# EAGLE schematic final_schematic (EAGLE 8.7.1)

## Sheet 1 of 4
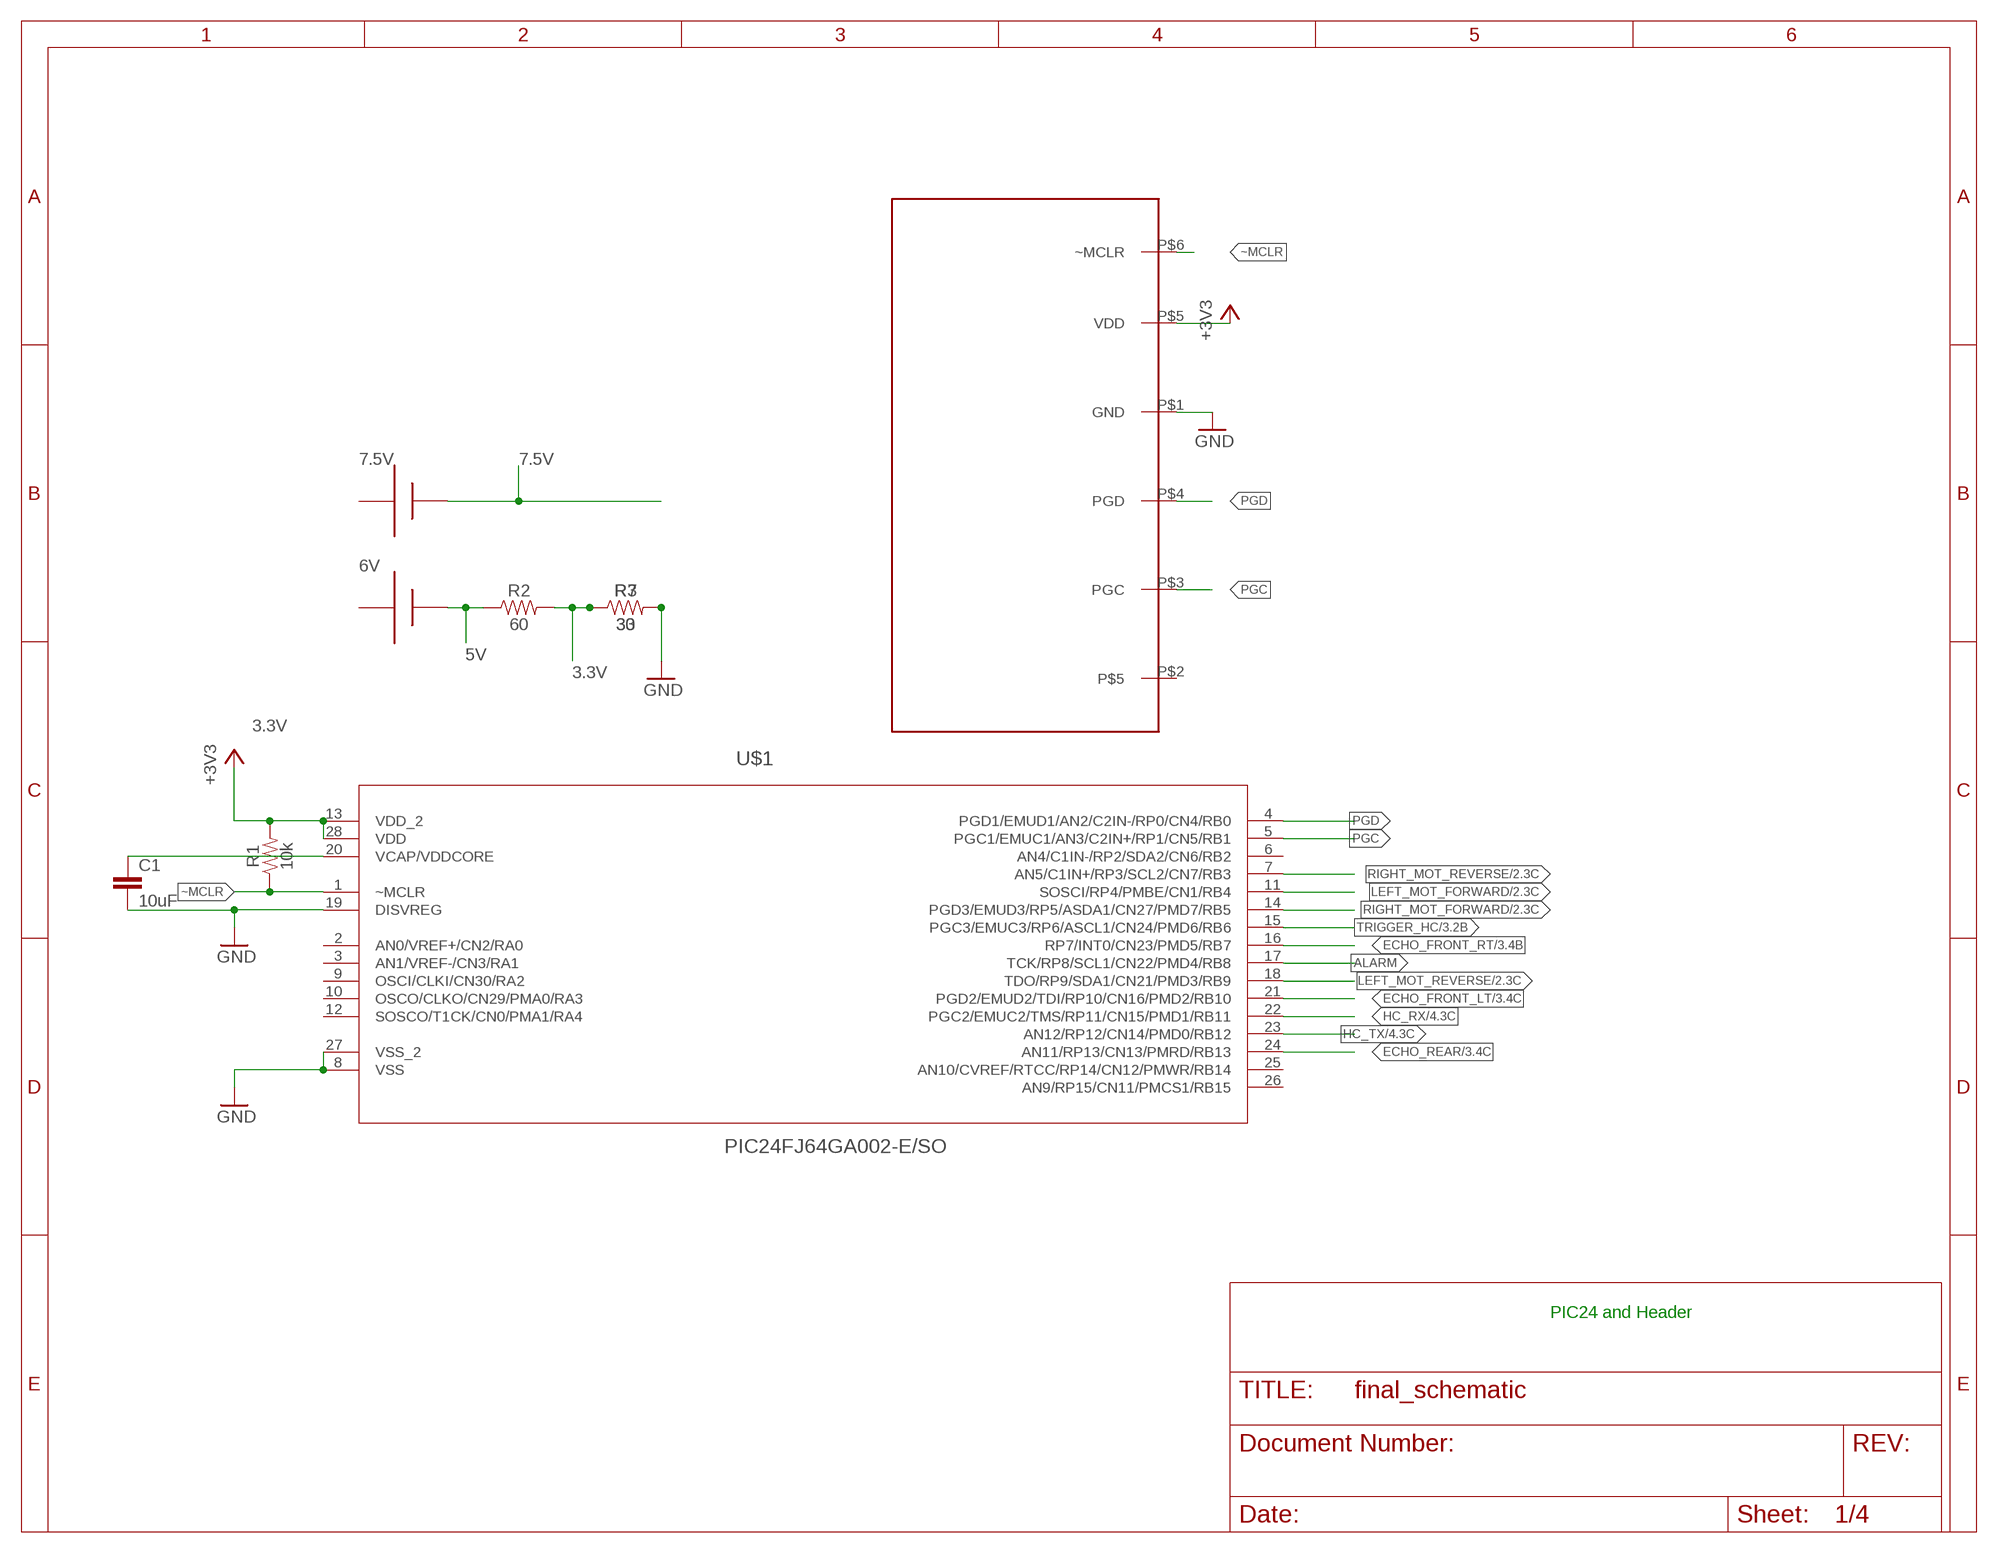
[diagram p0: schematic, sheet 1]

### Parts
6V  AAA  [12BH412]
7.5V  AAA  [12BH412]
C1  10uF  10UF-0603-6.3V-20%  [0603]
R1  10k  10KOHM-0603-1/10W-1%  [0603]
R2  60  33OHM-0603-1/10W-1%  [0603]
R3  33  33OHM-0603-1/10W-1%  [0603]
R7  30  33OHM-0603-1/10W-1%  [0603]
U$1  PIC24FJ64GA002-E/SO  [SOIC127P1030X265-28N]
U$2  CHIPKITHEADER  [HEADER]

### Nets
3.3V: R1.2 R2.2 R3.1 R7.1 U$1.13(VDD_2) U$1.28(VDD) ; supply symbol labelled +3V3 ; also sheet 3
5V: 6V.+ R2.1 ; also sheet 2,3,4
7.5V: 7.5V.+ ; also sheet 2
+3V3: U$2.P$5(VDD)
ALARM: U$1.17(TCK/RP8/SCL1/CN22/PMD4/RB8)
ECHO_FRONT_LT: U$1.21(PGD2/EMUD2/TDI/RP10/CN16/PMD2/RB10) ; also sheet 3
ECHO_FRONT_RT: U$1.16(RP7/INT0/CN23/PMD5/RB7) ; also sheet 3
ECHO_REAR: U$1.24(AN11/RP13/CN13/PMRD/RB13) ; also sheet 3
GND: C1.2 R3.2 R7.2 U$1.8(VSS) U$1.19(DISVREG) U$1.27(VSS_2) U$2.P$1(GND) ; also sheet 2,3,4
HC_RX: U$1.22(PGC2/EMUC2/TMS/RP11/CN15/PMD1/RB11) ; also sheet 4
HC_TX: U$1.23(AN12/RP12/CN14/PMD0/RB12) ; also sheet 4
LEFT_MOT_FORWARD: U$1.11(SOSCI/RP4/PMBE/CN1/RB4) ; also sheet 2
LEFT_MOT_REVERSE: U$1.18(TDO/RP9/SDA1/CN21/PMD3/RB9) ; also sheet 2
N$4: C1.1 U$1.20(VCAP/VDDCORE)
PGC: U$1.5(PGC1/EMUC1/AN3/C2IN+/RP1/CN5/RB1) U$2.P$3(PGC)
PGD: U$1.4(PGD1/EMUD1/AN2/C2IN-/RP0/CN4/RB0) U$2.P$4(PGD)
RIGHT_MOT_FORWARD: U$1.14(PGD3/EMUD3/RP5/ASDA1/CN27/PMD7/RB5) ; also sheet 2
RIGHT_MOT_REVERSE: U$1.7(AN5/C1IN+/RP3/SCL2/CN7/RB3) ; also sheet 2
TRIGGER_HC: U$1.15(PGC3/EMUC3/RP6/ASCL1/CN24/PMD6/RB6) ; also sheet 3
~MCLR: R1.1 U$1.1(~MCLR) U$2.P$6(~MCLR)
Unconnected: 6V.- 7.5V.- U$1.2(AN0/VREF+/CN2/RA0) U$1.3(AN1/VREF-/CN3/RA1) U$1.6(AN4/C1IN-/RP2/SDA2/CN6/RB2) U$1.9(OSCI/CLKI/CN30/RA2) U$1.10(OSCO/CLKO/CN29/PMA0/RA3) U$1.12(SOSCO/T1CK/CN0/PMA1/RA4) U$1.25(AN10/CVREF/RTCC/RP14/CN12/PMWR/RB14) U$1.26(AN9/RP15/CN11/PMCS1/RB15) U$2.P$2

### Notes on the sheet
- PIC24 and Header

## Sheet 2 of 4
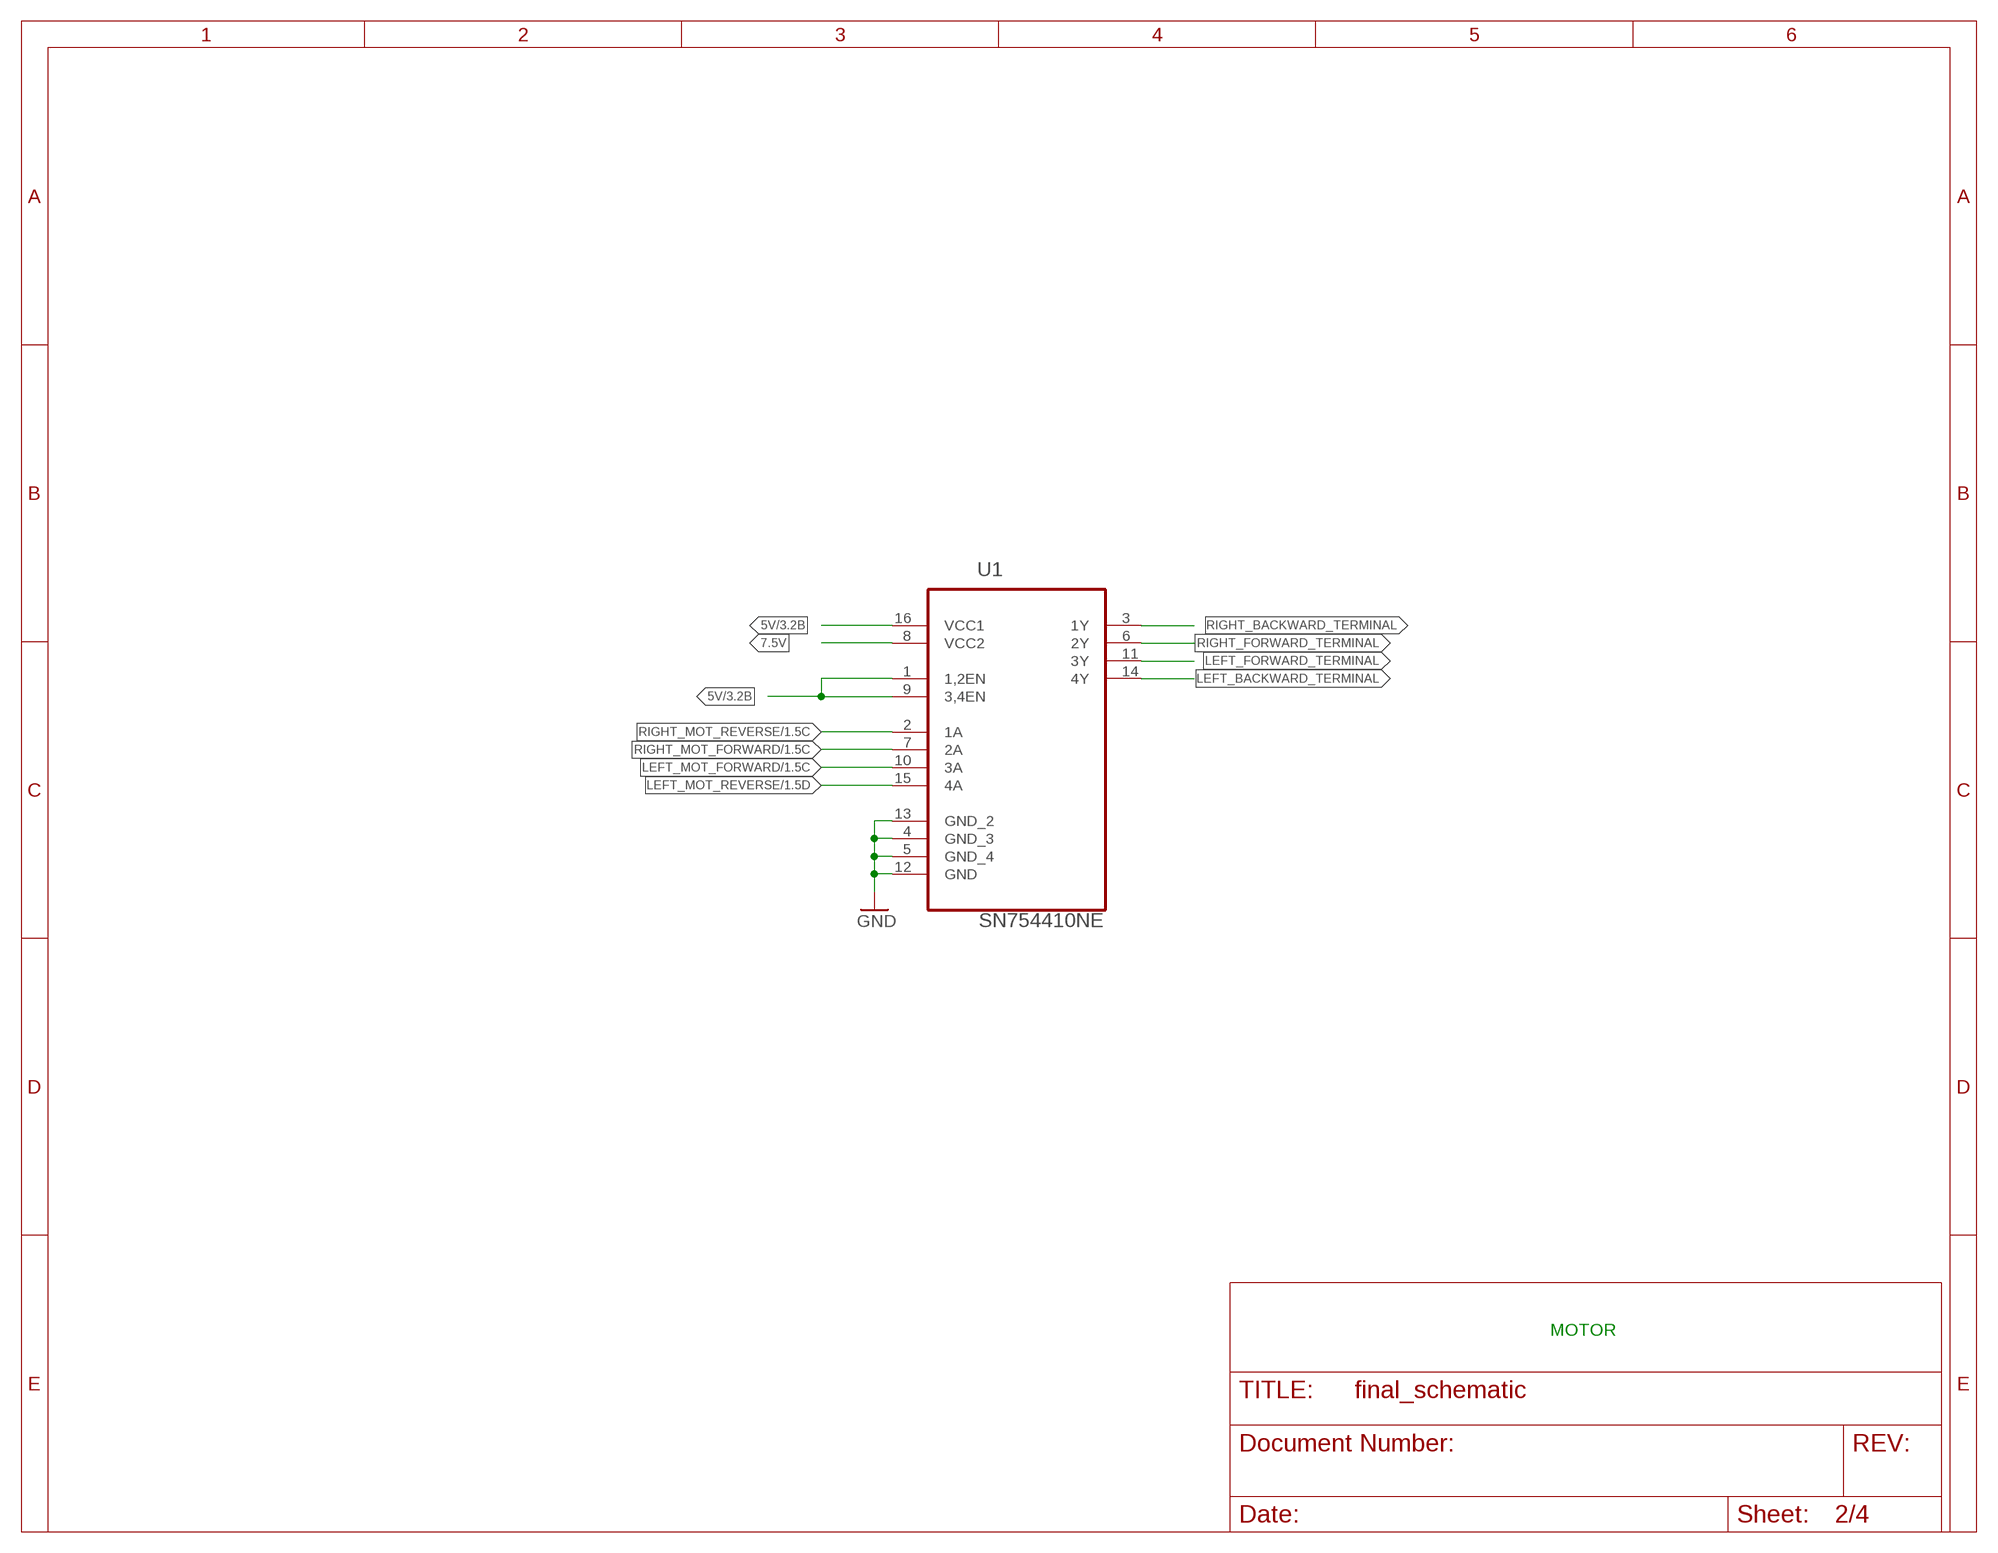
[diagram p1: schematic, sheet 2]

### Parts
U1  SN754410NE  [DIP254P762X508-16]

### Nets
5V: U1.1(1,2EN) U1.9(3,4EN) U1.16(VCC1) ; also sheet 1,3,4
7.5V: U1.8(VCC2) ; also sheet 1
GND: U1.4(GND_3) U1.5(GND_4) U1.12(GND) U1.13(GND_2) ; also sheet 1,3,4
LEFT_BACKWARD_TERMINAL: U1.14(4Y)
LEFT_FORWARD_TERMINAL: U1.11(3Y)
LEFT_MOT_FORWARD: U1.10(3A) ; also sheet 1
LEFT_MOT_REVERSE: U1.15(4A) ; also sheet 1
RIGHT_BACKWARD_TERMINAL: U1.3(1Y)
RIGHT_FORWARD_TERMINAL: U1.6(2Y)
RIGHT_MOT_FORWARD: U1.7(2A) ; also sheet 1
RIGHT_MOT_REVERSE: U1.2(1A) ; also sheet 1

### Notes on the sheet
- MOTOR

## Sheet 3 of 4
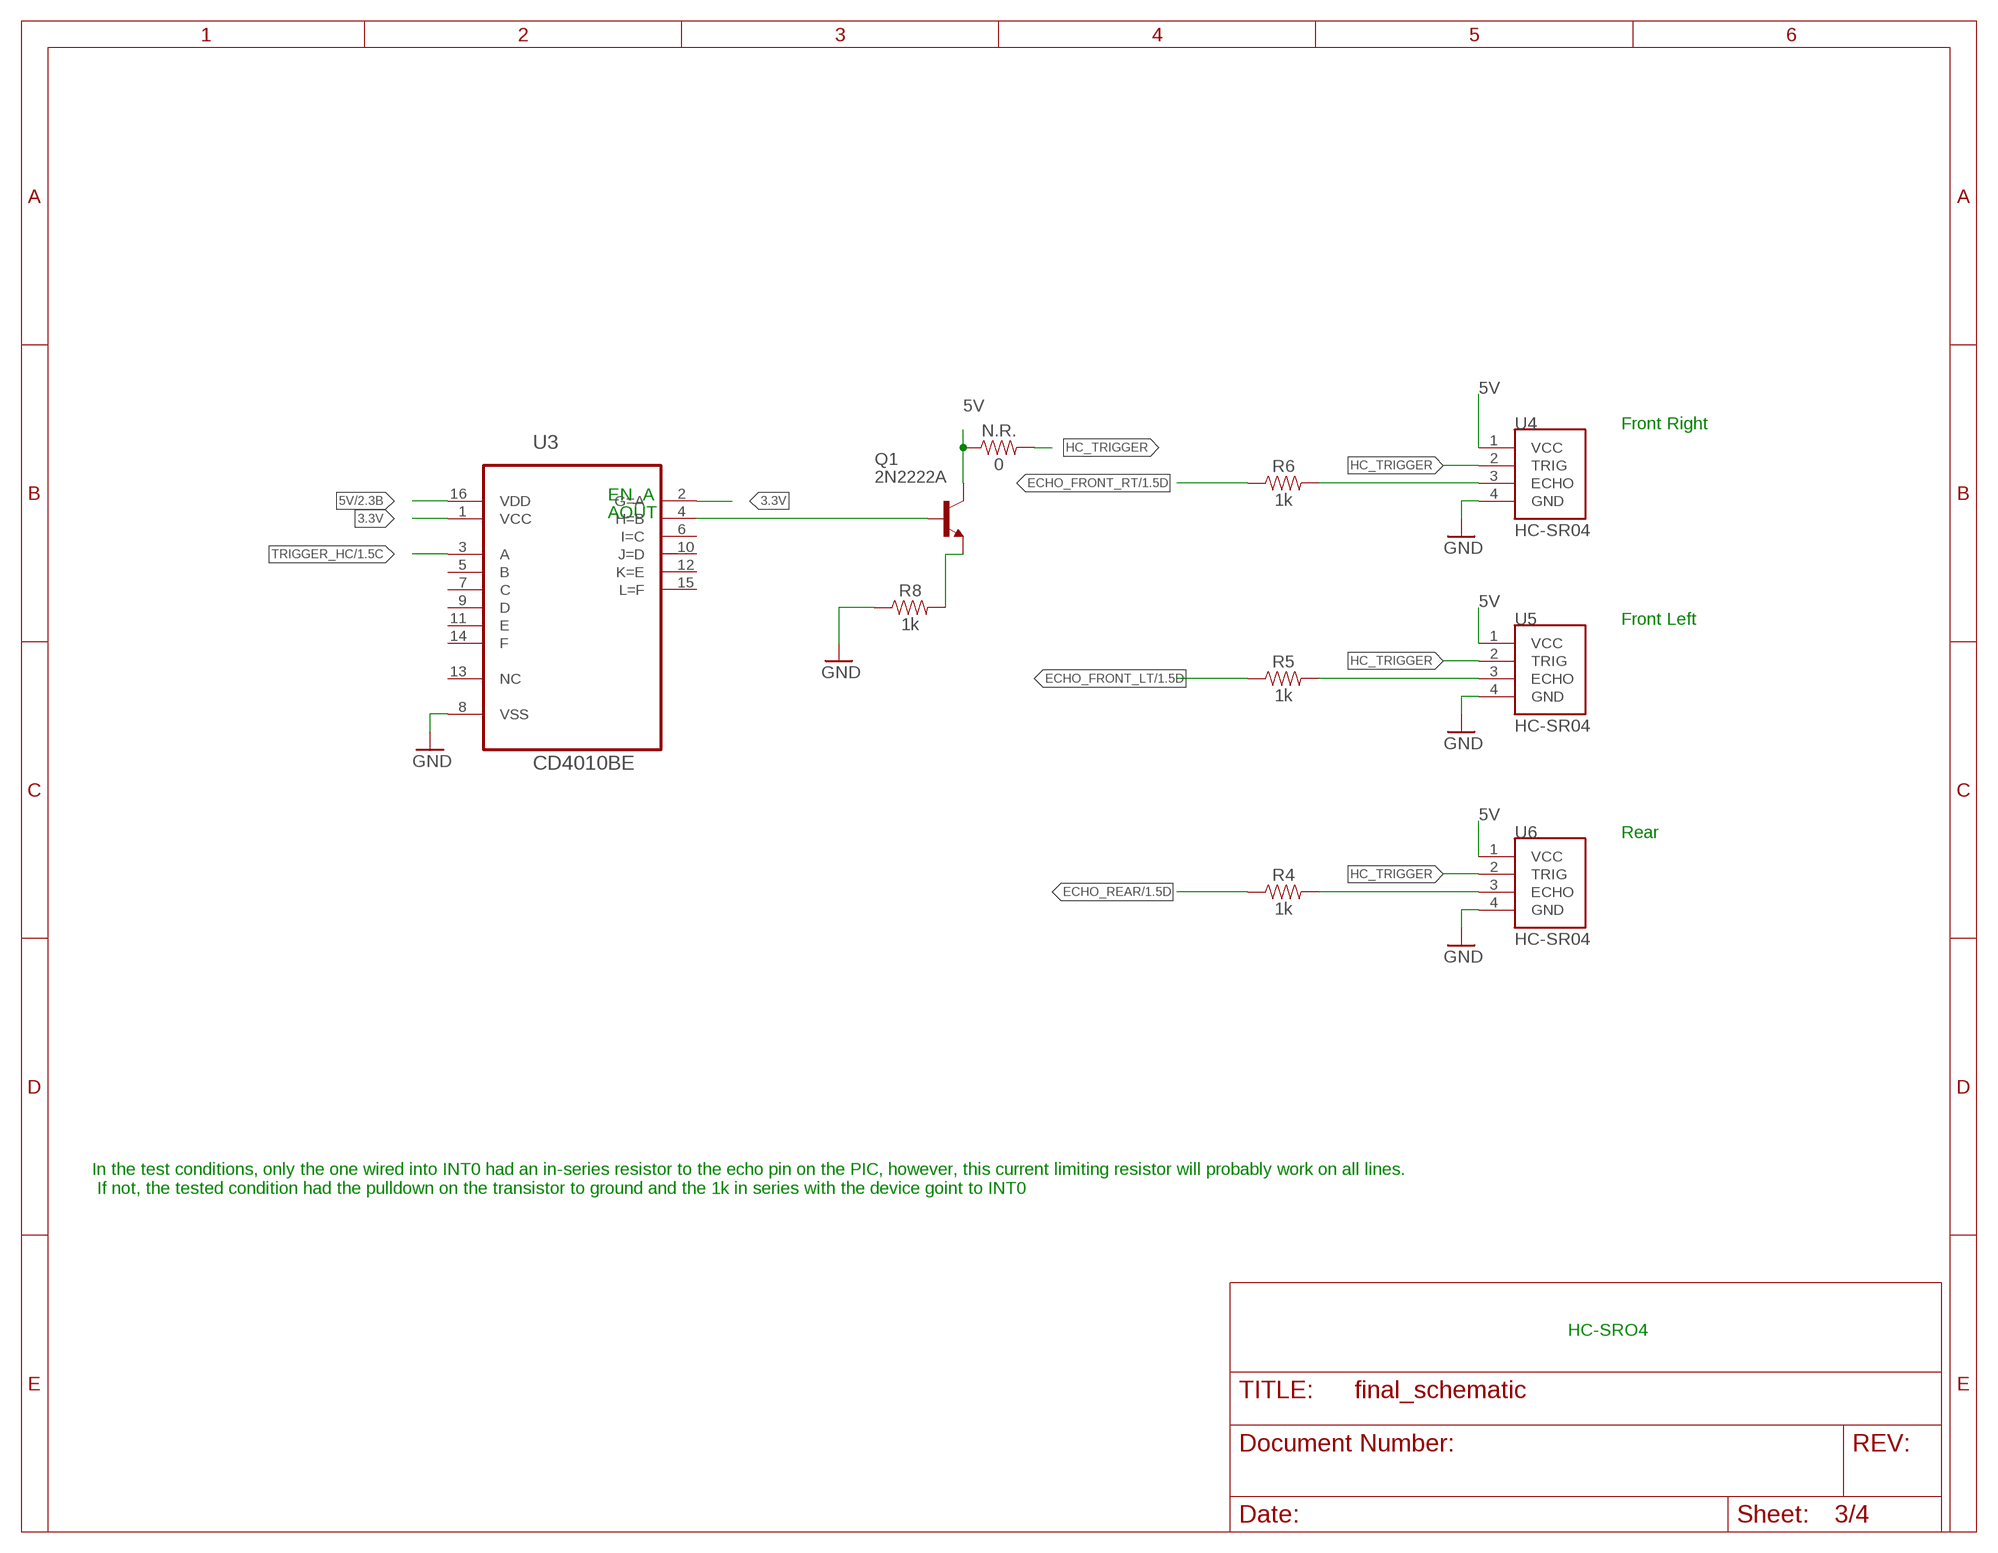
[diagram p2: schematic, sheet 3]

### Parts
N.R.  0  0.1OHM-1210-1/2W-1%  [1210]
Q1  2N2222A  [TO18]
R4  1k  1KOHM-0603-1/10W-1%  [0603]
R5  1k  1KOHM-0603-1/10W-1%  [0603]
R6  1k  1KOHM-0603-1/10W-1%  [0603]
R8  1k  1KOHM-0603-1/10W-1%  [0603]
U3  CD4010BE  [DIP254P762X508-16]
U4  HC-SR04  [XCVR_HC-SR04]
U5  HC-SR04  [XCVR_HC-SR04]
U6  HC-SR04  [XCVR_HC-SR04]

### Nets
3.3V: U3.1(VCC) U3.2(G=A) ; also sheet 1
5V: N.R..1 Q1.3(C) U3.16(VDD) U4.1(VCC) U5.1(VCC) U6.1(VCC) ; also sheet 1,2,4
ECHO_FRONT_LT: R5.1 ; also sheet 1
ECHO_FRONT_RT: R6.1 ; also sheet 1
ECHO_REAR: R4.1 ; also sheet 1
GND: R8.1 U3.8(VSS) U4.4(GND) U5.4(GND) U6.4(GND) ; also sheet 1,2,4
HC_TRIGGER: N.R..2 Q1.1(E) Q1.2(B) R8.2 U3.4(H=B) U4.2(TRIG) U5.2(TRIG) U6.2(TRIG)
N$1: R4.2 U6.3(ECHO)
N$2: R6.2 U4.3(ECHO)
N$3: R5.2 U5.3(ECHO)
TRIGGER_HC: U3.3(A) ; also sheet 1
Unconnected: U3.5(B) U3.6(I=C) U3.7(C) U3.9(D) U3.10(J=D) U3.11(E) U3.12(K=E) U3.13(NC) U3.14(F) U3.15(L=F)

### Notes on the sheet
- Front Right
- EN_A
- AOUT
- Front Left
- Rear
- In the test conditions, only the one wired into INT0 had an in-series resistor to the echo pin on the PIC, however, this current limiting resistor will probably work on all lines.
   If not, the tested condition had the pulldown on the transistor to ground and the 1k in series with the device goint to INT0
- HC-SRO4

## Sheet 4 of 4
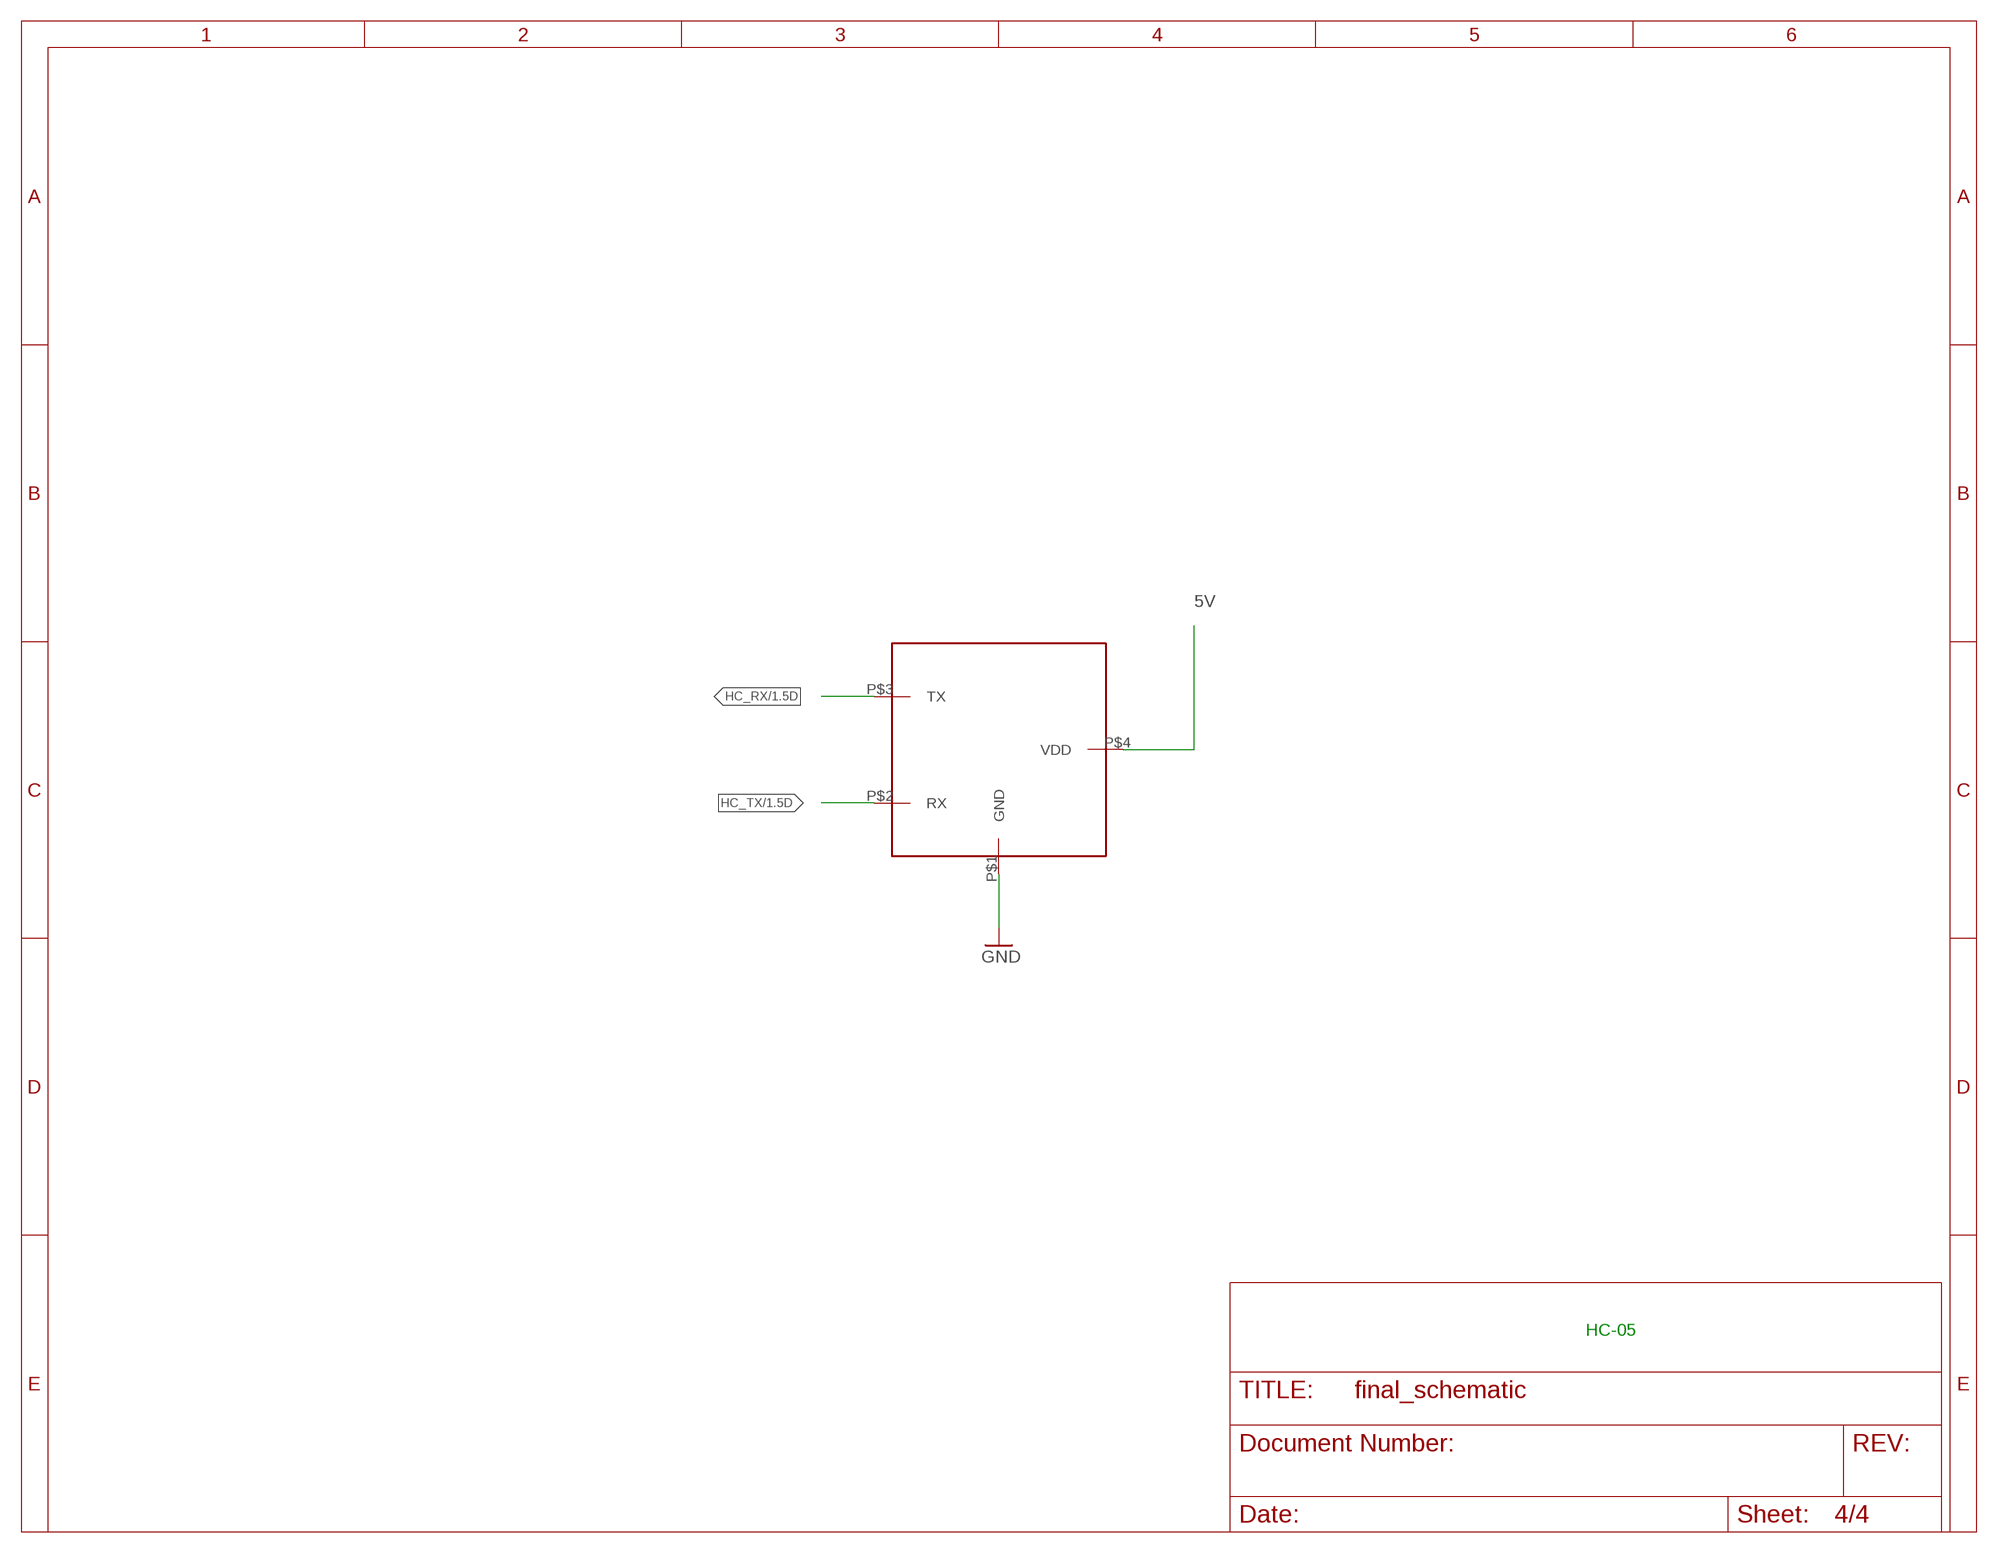
[diagram p3: schematic, sheet 4]

### Parts
U$3  HC-05  [HEADER]

### Nets
5V: U$3.P$4(VDD) ; also sheet 1,2,3
GND: U$3.P$1(GND) ; also sheet 1,2,3
HC_RX: U$3.P$3(TX) ; also sheet 1
HC_TX: U$3.P$2(RX) ; also sheet 1

### Notes on the sheet
- HC-05

## Library data of the parts
6V 7.5V = adafruit:AAA: AAA PC pin holder Mouser part #12BH412 - but pretty much any 1x AAA battery holder should be the same http://www.ladyada.net/library/pcb/eaglelibrary.html
C1 = SparkFun-Capacitors:10UF: 10.0µF ceramic capacitors A capacitor is a passive two-terminal electrical component used to store electrical energy temporarily in an electric field.; PROD_ID: CAP-11015
N.R. = SparkFun-Resistors:0.1OHM: 0.1Ω resistor A resistor is a passive two-terminal electrical component that implements electrical resistance as a circuit element. Resistors act to reduce current flow, and, at the same time, act to lower voltage levels within circuits. - Wikipedia; PROD_ID: RES-12374; VALUE: 0.1
Q1 = transistor-npn:2N2222*: NPN Transistor
R1 = SparkFun-Resistors:10KOHM: 10kΩ resistor A resistor is a passive two-terminal electrical component that implements electrical resistance as a circuit element. Resistors act to reduce current flow, and, at the same time, act to lower voltage levels within circuits. - Wikipedia; PROD_ID: RES-00824
R2 R7 = SparkFun-Resistors:33OHM: 33Ω resistor A resistor is a passive two-terminal electrical component that implements electrical resistance as a circuit element. Resistors act to reduce current flow, and, at the same time, act to lower voltage levels within circuits. - Wikipedia; PROD_ID: RES-08270; VALUE: 33
R3 = SparkFun-Resistors:33OHM: 33Ω resistor A resistor is a passive two-terminal electrical component that implements electrical resistance as a circuit element. Resistors act to reduce current flow, and, at the same time, act to lower voltage levels within circuits. - Wikipedia; PROD_ID: RES-08270
R4-R6 R8 = SparkFun-Resistors:1KOHM: 1kΩ resistor A resistor is a passive two-terminal electrical component that implements electrical resistance as a circuit element. Resistors act to reduce current flow, and, at the same time, act to lower voltage levels within circuits. - Wikipedia; PROD_ID: RES-07856
U1 = SN754410NE:SN754410NE: QUADRUPLE HALF-H DRIVERS; AVAILABILITY: Good; DESCRIPTION: Peripheral Drivers and Actuators Quad Half-Hs; MF: Texas Instruments; MP: SN754410NE; PACKAGE: PDIP-16 Texas Instruments; PRICE: 1.87 USD
U3 = CD4010BE:CD4010BE: CMOS HEX BUFF/CONVERTER; AVAILABILITY: Good; DESCRIPTION: IC: digital; buffer, converter; Channels: 6; CMOS; THT; DIP14; MF: Texas Instruments; MP: CD4010BE; PACKAGE: PDIP-16 Texas Instruments; PRICE: 0.31 USD
U4-U6 = HC-SR04:HC-SR04: Ultrasonic Sensor Module; AVAILABILITY: Bad; DESCRIPTION: Ultrasonic Sensor Module; MF: OSEPP; MP: HC-SR04; PACKAGE: None; PRICE: 5.95 USD
U$1 = PIC24FJ64GA002-E_SO:PIC24FJ64GA002-E/SO: 16-Bit Flash Microcontrollers; AVAILABILITY: Bad; DESCRIPTION: 16-bit Family, 16 MIPS, 64KB Flash, 8192 bytes RAM, 21 I/O, nanoWatt; MF: Microchip; MP: PIC24FJ64GA002-E/SO; PACKAGE: SOIC-28 Microchip; PRICE: 2.89 USD
U$2 = chipkit:CHIPKITHEADER
U$3 = finalproject:HC-05